# Altium schematic sheet SCH_WINGLET_PWR.SchDoc: Winglet Power Supply
size B; DrawnBy: HCAdam; Organization: Aerospace Village; DocumentNumber: WINGLET; Revision: A; SheetNumber: 2; SheetTotal: 10
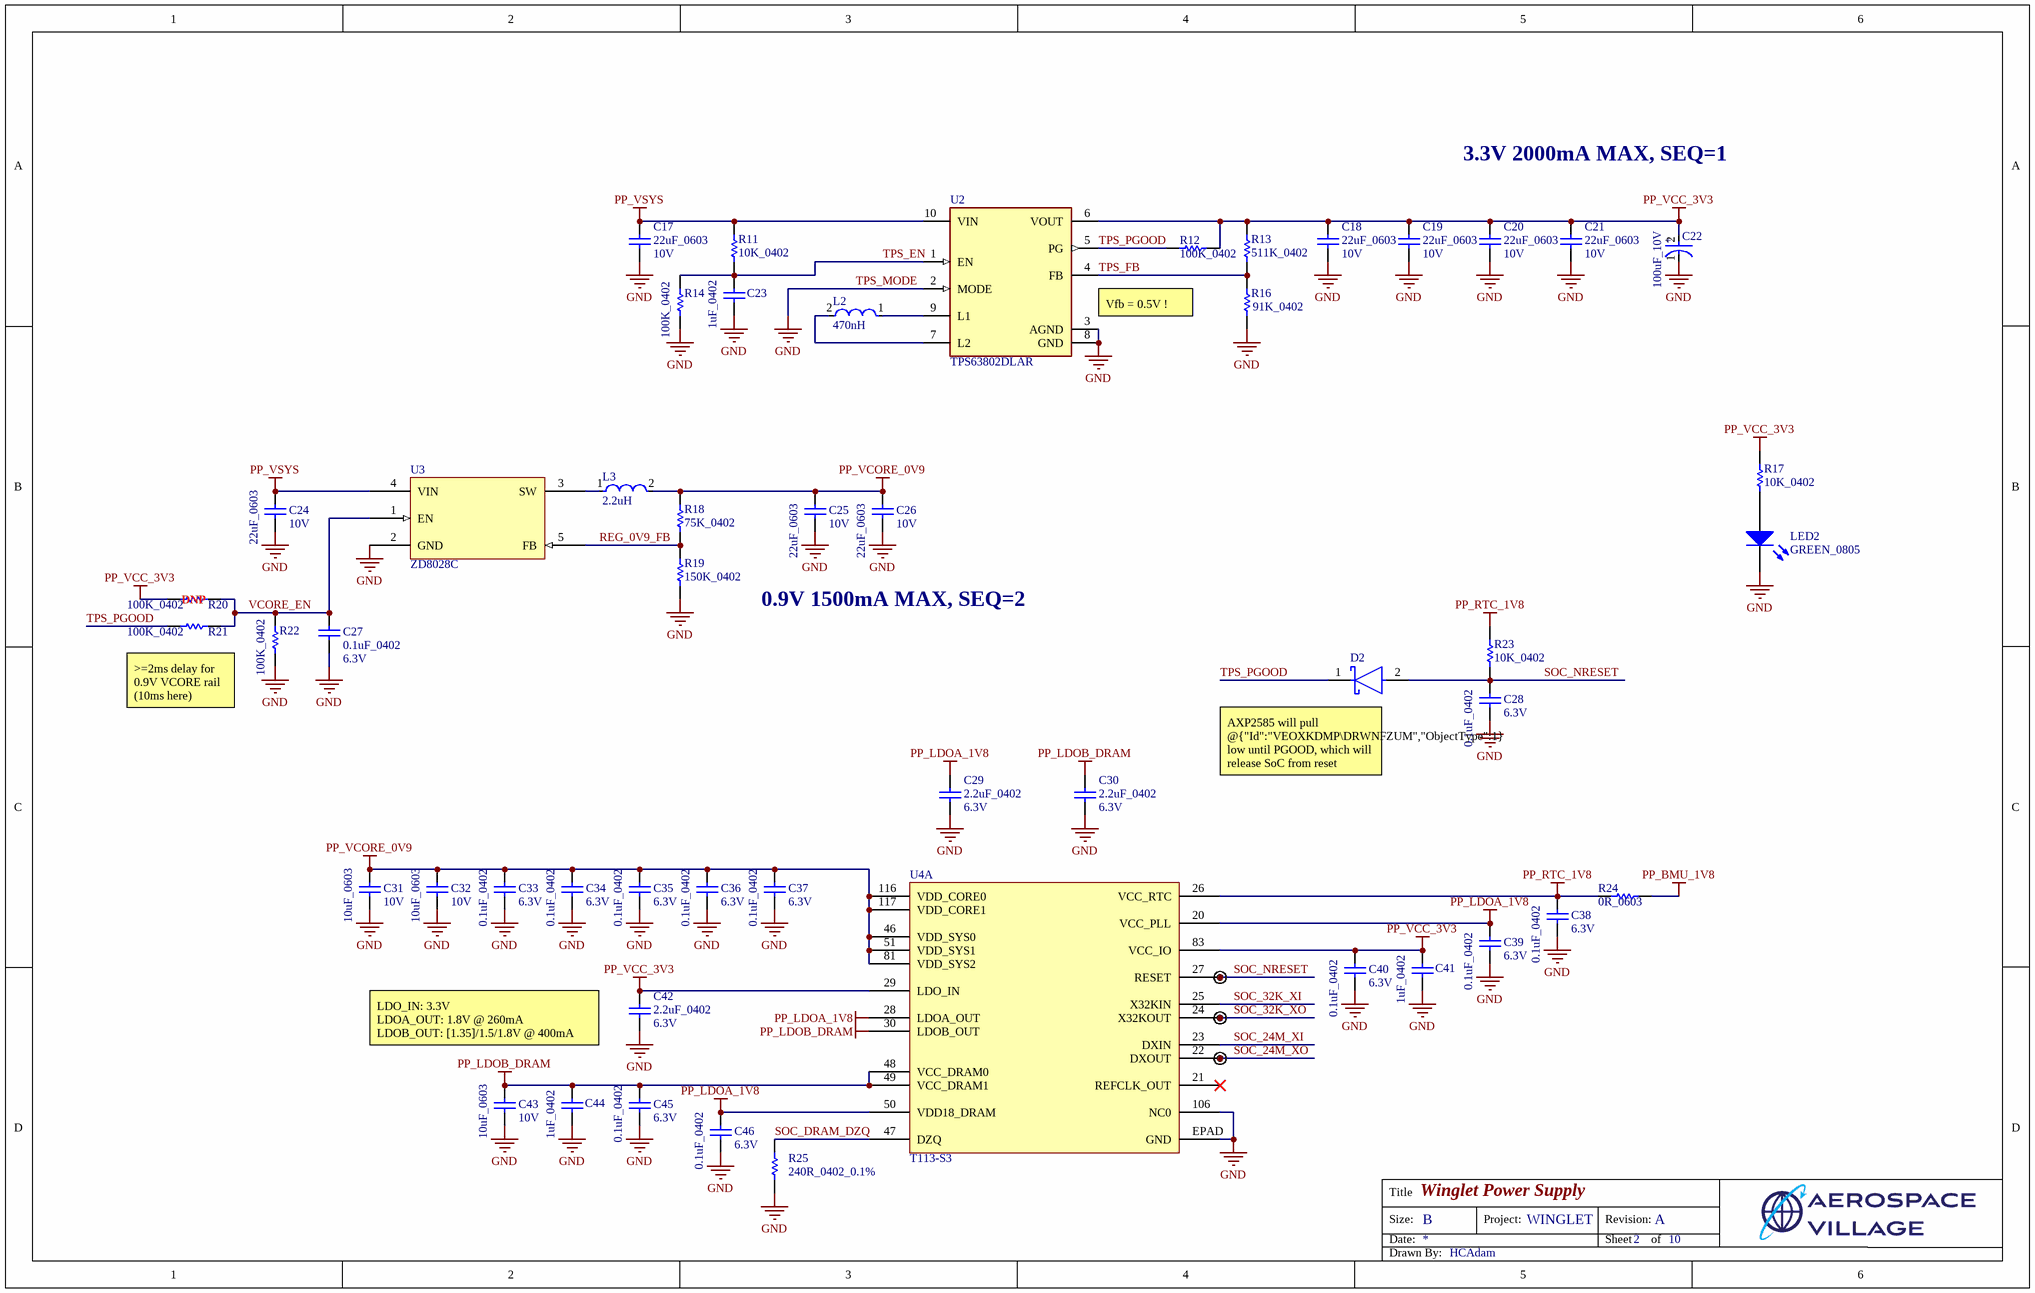
[diagram p0: SCH_WINGLET_PWR.SchDoc]

## Parts
C17  22uF_0603  Voltage Rating: 10V  [CAPC1608X100X20NL10]
C18  22uF_0603  Voltage Rating: 10V  [CAPC1608X100X20NL10]
C19  22uF_0603  Voltage Rating: 10V  [CAPC1608X100X20NL10]
C20  22uF_0603  Voltage Rating: 10V  [CAPC1608X100X20NL10]
C21  22uF_0603  Voltage Rating: 10V  [CAPC1608X100X20NL10]
C22  100uF_10V  [FP-TAJB-MFG]
C23  1uF_0402  [CAPC1005X55X25NL5T10]
C24  22uF_0603  Voltage Rating: 10V  [CAPC1608X100X20NL10]
C25  22uF_0603  Voltage Rating: 10V  [CAPC1608X100X20NL10]
C26  22uF_0603  Voltage Rating: 10V  [CAPC1608X100X20NL10]
C27  0.1uF_0402  Voltage Rating: 6.3V  [CAPC1005X56X25NL10T15]
C28  0.1uF_0402  Voltage Rating: 6.3V  [CAPC1005X56X25NL10T15]
C29  2.2uF_0402  Voltage Rating: 6.3V  [CAPC1005X55X25NL05T10]
C30  2.2uF_0402  Voltage Rating: 6.3V  [CAPC1005X55X25NL05T10]
C31  10uF_0603  Voltage Rating: 10V  [CAPC1609X100X15NL20]
C32  10uF_0603  Voltage Rating: 10V  [CAPC1609X100X15NL20]
C33  0.1uF_0402  Voltage Rating: 6.3V  [CAPC1005X56X25NL10T15]
C34  0.1uF_0402  Voltage Rating: 6.3V  [CAPC1005X56X25NL10T15]
C35  0.1uF_0402  Voltage Rating: 6.3V  [CAPC1005X56X25NL10T15]
C36  0.1uF_0402  Voltage Rating: 6.3V  [CAPC1005X56X25NL10T15]
C37  0.1uF_0402  Voltage Rating: 6.3V  [CAPC1005X56X25NL10T15]
C38  0.1uF_0402  Voltage Rating: 6.3V  [CAPC1005X56X25NL10T15]
C39  0.1uF_0402  Voltage Rating: 6.3V  [CAPC1005X56X25NL10T15]
C40  0.1uF_0402  Voltage Rating: 6.3V  [CAPC1005X56X25NL10T15]
C41  1uF_0402  [CAPC1005X55X25NL5T10]
C42  2.2uF_0402  Voltage Rating: 6.3V  [CAPC1005X55X25NL05T10]
C43  10uF_0603  Voltage Rating: 10V  [CAPC1609X100X15NL20]
C44  1uF_0402  [CAPC1005X55X25NL5T10]
C45  0.1uF_0402  Voltage Rating: 6.3V  [CAPC1005X56X25NL10T15]
C46  0.1uF_0402  Voltage Rating: 6.3V  [CAPC1005X56X25NL10T15]
D2  BAT54KFILM  [FP-SOD-523-MFG]  (value not drawn)
L2  470nH  [FP-DFE252012C-IPC_A]
L3  2.2uH  [FP-NR3015-MFG]
LED2  GREEN_0805  [0805_A]
R11  10K_0402  [RESC1005X40X25NL05T05]
R12  100K_0402  [RESC1005X40X25NL05T10]
R13  511K_0402  [RESC1005X40X25NL05T10]
R14  100K_0402  [RESC1005X40X25NL05T10]
R16  91K_0402  [RESC1005X40X25NL05T10]
R17  10K_0402  [RESC1005X40X25NL05T05]
R18  75K_0402  [RESC1005X40X25NL05T05]
R19  150K_0402  [RESC1005X40X25NL05T05]
R20  100K_0402  [RESC1005X40X25NL05T10]
R21  100K_0402  [RESC1005X40X25NL05T10]
R22  100K_0402  [RESC1005X40X25NL05T10]
R23  10K_0402  [RESC1005X40X25NL05T05]
R24  0R_0603  [RESC1608X55X25LL10T15]
R25  240R_0402_0.1%  [RESC1005X40X25NL05T05]
TP4  TESTPOINT  [TESTPOINT-0.7MM-SINGLE-LAYER]  (value not drawn)  (no BOM)
TP5  TESTPOINT  [TESTPOINT-0.7MM-SINGLE-LAYER]  (value not drawn)  (no BOM)
TP6  TESTPOINT  [TESTPOINT-0.7MM-SINGLE-LAYER]  (value not drawn)  (no BOM)
U2  TPS63802DLAR  [FP-DLA0010A-MFG]
U3  ZD8028C  [SOT95P292X115-5N]
U4  T113-S3  [TSQFP40P1600X1600X160_HS-129N]  (part A of 7)

## Nets
PP_BMU_1V8: R24.2
PP_LDOA_1V8: C29.2 C39.2 C46.2 U4.20(VCC_PLL) U4.28(LDOA_OUT) U4.50(VDD18_DRAM)
PP_LDOB_DRAM: C30.2 C43.2 C44.2 C45.2 U4.30(LDOB_OUT) U4.48(VCC_DRAM0) U4.49(VCC_DRAM1)
PP_RTC_1V8: C38.2 R23.2 R24.1 U4.26(VCC_RTC)
PP_VCC_3V3: C18.2 C19.2 C20.2 C21.2 C22.2(A) C40.2 C41.2 C42.2 R12.2 R13.1 R17.2 R20.2 U2.6(VOUT) U4.29(LDO_IN) U4.83(VCC_IO)
PP_VCORE_0V9: C25.2 C26.2 C31.2 C32.2 C33.2 C34.2 C35.2 C36.2 C37.2 L3.2 R18.2 U4.46(VDD_SYS0) U4.51(VDD_SYS1) U4.81(VDD_SYS2) U4.116(VDD_CORE0) U4.117(VDD_CORE1)
PP_VSYS: C17.2 C24.2 R11.1 U2.10(VIN) U3.4(VIN)
TPS_MODE: C17.1 C18.1 C19.1 C20.1 C21.1 C22.1(C) C23.1 C24.1 C25.1 C26.1 C27.1 C28.1 C29.1 C30.1 C31.1 C32.1 C33.1 C34.1 C35.1 C36.1 C37.1 C38.1 C39.1 C40.1 C41.1 C42.1 C43.1 C44.1 C45.1 C46.1 LED2.1(K) R14.2 R16.2 R19.1 R22.2 R25.1 U2.2(MODE) U2.3(AGND) U2.8(GND) U3.2(GND) U4.106(NC0) U4.EPAD(GND)  [also labelled GND]
REG_0V9_FB: R18.1 R19.2 U3.5(FB)
SOC_24M_XI: U4.23(DXIN)
SOC_24M_XO: TP6.1 U4.22(DXOUT)
SOC_32K_XI: U4.25(X32KIN)
SOC_32K_XO: TP5.1 U4.24(X32KOUT)
SOC_DRAM_DZQ: R25.2 U4.47(DZQ)
SOC_NRESET: C28.2 D2.2(A) R23.1 TP4.1 U4.27(RESET)
TPS_EN: C23.2 R11.2 R14.1 U2.1(EN)
TPS_FB: R13.2 R16.1 U2.4(FB)
TPS_PGOOD: D2.1(C) R12.1 R21.2 U2.5(PG)
VCORE_EN: C27.2 R20.1 R21.1 R22.1 U3.1(EN)
NetL2_1: L2.1 U2.9(L1)
NetL2_2: L2.2 U2.7(L2)
NetL3_1: L3.1 U3.3(SW)
NetLED2_2: LED2.2(A) R17.1

Not connected (* = marked no-connect by the designer): U4 21(REFCLK_OUT)*

## Notes on the sheet
- 3.3V 2000mA MAX, SEQ=1
- Vfb = 0.5V !
- 0.9V 1500mA MAX, SEQ=2
- >=2ms delay for 0.9V VCORE rail (10ms here)
- (near D2) AXP2585 will pull @{"Id":"VEOXKDMP\DRWNFZUM","ObjectType":1} low until PGOOD, which will release SoC from reset
- LDO_IN: 3.3V
  LDOA_OUT: 1.8V @ 260mA
  LDOB_OUT: [1.35]/1.5/1.8V @ 400mA
- Title
- Size:
- Date:
- B
- Project:
- Revision:
- Sheet
- of
- Drawn By:
- (in symbol CMP-04424-000366-1) +

## Library data of the parts
C17-C21 C24-C26 = CMP-2000-05441-1: Chip Capacitor, 22 uF, +/- 20%, 10 V, -55 to 85 degC, 0603 (1608 Metric), RoHS, Tape and Reel / PN: C1608X5R1A226M080AC; Manufacturer: TDK; PCN Part Number: MLCCPartNumberChange30/Nov/2012; Product Training Modules: CSeriesGeneralApplicationsSEAT,CCV,andTVCLDesignToolsGuidetoReplacinganElectrolyticCapacitorwithanMLCC; Other Names: 445-9077-1; Design Resources: 20WNon-IsolatedBuckLEDDriverUsingPLLNK460KG; Online Catalog: CSeries,GeneralPurpose; Capacitance: 22µF; Temperature Coefficient: X5R; Kits: 445-9014-KIT-ND-KITMLCC100PF-22UF060310-50V; Packaging: CutTape(CT); Standard Package: 1; Package / Case: 0603(1608Metric); Lead Style: -; Features: -; Ratings: -; Voltage - Rated: 10V; Operating Temperature: -55degC~85degC; Applications: GeneralPurpose; Package Reference: 603; Datasheet URL: http://download.siliconexpert.com/pdfs/2015/4/21/15/54/45/779/tdk_/manual/37024850441143360mlcc_commercial_general_en.pdf; Datasheet Version: Mar-15; Mounting Type: SurfaceMount,MLCC; Lead Spacing: -; Size / Dimension: 0.063"Lx0.031"W(1.60mmx0.80mm); Height - Seated (Max): -; Package Description: 2-Pin Surface Mount Device, Body 1.6 x 0.8 mm; Manufacturer URL: http://www.tdk.com/; RoHS Information: RoHSCertificate-MLCC; Tolerance: ±20%; Series: C; Thickness (Max): 0.035"(0.90mm); Family: CeramicCapacitors; Category: Capacitors
C22 = CMP-04424-000366-1: 100uF 10V ±10% 1.7Ω SMD CASE-B (3528) Tantalum Capacitor; Voltage Rating (DC): 6.3V; ESR (Equivalent Series Resistance): 1.7R; Polarity: Polar; Leakage Current: 6.3uA; Height: 1.9mm; Depth: 2.8mm; Length: 3.5mm; Min Operating Temperature: -55°C; Width: 2.8mm; Series: TAJ; Lead Free: Lead Free; Case/Package: 1210; Voltage: 6.3V; Mount: Surface Mount; Tolerance: 10%; Capacitance: 100uF; Radiation Hardening: No; REACH SVHC: No SVHC; Voltage Rating: 6.3V; Case Code (Metric): 3528; Dissipation Factor: 10%; Packaging: Tape and Reel; Construction: Flat; Features: General Purpose; Max Operating Temperature: 125°C; RoHS Compliant: Yes; Package Quantity: 1; Dielectric Material: Tantalum; Termination: SMD/SMT; Case Code (Imperial): 1210; Height - Seated (Max): 0.083inch
C23 C41 C44 = CMP-1662-00020-1: Chip Capacitor, 1 uF, +/- 10%, 6.3 V, -55 to 85 degC, 0402 (1005 Metric), RoHS, Tape and Reel / GRM155R60J105KE19D; Voltage Rating (DC): 3 V; Type (Capacitors): X5R; Voltage Rating: 6.3 V; Capacitance: 1 uF; ComponentLink2Description: Datasheet; ComponentLink2URL: http://psearch.en.murata.com/capacitor/product/GRM155R60J105KE19%23.pdf; Max Operating Temperature: 85 degC; Min Operating Temperature: -55 degC; Package Quantity: 10000; Mounting Technology: Surface Mount; ComponentLink1Description: Manufacturer URL; ComponentLink1URL: http://www.murata.com/; PackageDescription: 2-Pin Surface Mount Device, Body 1 x 0.5 mm; Tolerance: 10%; Case/Package: 0402; Mount: Surface Mount; Packaging: Tape and Reel; Case Code (Metric): 1005; Radiation Hardening: No; Width: 0.5 mm; Length: 1 mm; DatasheetVersion: 08/2016; Height: 0.5 mm; PartNumber: GRM155R60J105KE19D; RoHSCompliant: true; Case Code (Imperial): 0402; REACH SVHC: No SVHC; Pins: 2
C27 C28 C33-C40 C45 C46 = CMP-2008-02743-1: 04026D104KAT2A; Manufacturer: AVX Interconnect / Elco; Part Number: 04026D104KAT2A
C29 C30 C42 = CMP-2008-04543-1: GRM155R60J225ME15D; Manufacturer: Murata; Part Number: GRM155R60J225ME15D
C31 C32 C43 = CMP-2006-00191-1: Part Number: TACL106M006XTA; Manufacturer: AVX Interconnect / Elco
D2 = CMP-12187-000026-1: DIODE SCHOTTKY 40V 300MA SOD523; Manufacturer: STMicroelectronics; Capacitance: 7pF; Value: 7pF; Max Surge Forward Current: 1.25A; Peak Reverse Current: 1uA; Max Junction Temp: +150°C; Device Class L2: Diodes; Temperature Range Low: -40°C; Category: Diode; Manufacturer Part Number: BAT54KFILM; Digikey Description: DIODE SCHOTTKY 40V 300MA SOD523; Device Class L3: Schottky Diodes; Automotive: No; Height: 0.7mm; Octopart: https://octopart.com/bat54kfilm-stmicroelectronics-39618022; ComponentLink2Description: Datasheet; Temperature Range High: +150°C; Device Class L1: Discrete Semiconductors; Max Repetitive Reverse Voltage: 40V; RoHS: TRUE; Temperature: -40°C to +150°C; ComponentLink2URL: https://www.st.com/content/ccc/resource/technical/document/datasheet/07/50/54/f2/0d/ba/4a/79/CD00001322.pdf/files/CD00001322.pdf/jcr:content/translations/en.CD00001322.pdf; Lead Free: Yes; Forward Current: 300mA; Package: SOD-523; Mouser Description: Schottky Diodes & Rectifiers schottky diode
L2 = CMP-06042-015149-1: Shielded Wirewound Inductor 0.47uH 20% 4000mA 0.027Ω 1008 (2520) / DFE252012PD-R47M
L3 = CMP-0569-00001-3: SMD Power Inductors 2.2uH ±20% 1.48A 72mΩ / NR3015T2R2M; RMS Current (Irms): 1.5A; Shielding: Shielded; Self Resonant Frequency: 64MHz; Test Frequency: 100kHz; DC Resistance (DCR): 72mR; Core Material: Ferrite; Package Quantity: 1; Current Rating: 1.48A; Height - Seated (Max): 0.059inch; Width: 0.118inch; Inductance Tolerance: 20%; Tolerance: 20%; Resistor Type: Wirewound; RoHS Compliant: Yes; Case/Package: 3015; Length: 0.118inch; Max DC Current: 1.5A; Max Operating Temperature: 120°C; Inductance: 2.2uH; Saturation Current: 1.48A; Min Operating Temperature: -25°C; Height: 1.5mm; Series: NR; Lead Free: Lead Free; Packaging: Tape and Reel; Halogen Free: Halogen Free; Termination: SMD/SMT; Number of Pins: 2
LED2 = CMP-1426-00007-1: SMD mono-color Chip LED, WL-SMCW, Green / 150080GS75000; Manufacturer: Wuerth Elektronik; PackageReference: 0805_A; Color: Green; PartNumber: 150080GS75000; ComponentLink2URL: http://katalog.we-online.com/led/datasheet/150080GS75000.pdf; ComponentLink1URL: http://www.we-online.com; ComponentLink1Description: Manufacturer URL; ComponentLink2Description: Datasheet
R11 R17 R23 = CMP-2000-07588-1: Chip Resistor, 10 KOhm, +/- 1%, 0.1 W, -55 to 155 degC, 0402 (1005 Metric), RoHS, Tape and Reel / ERJ2RKF1002X; Manufacturer: Panasonic; Power Rating: 100mW; Voltage Rating: 50V; Resistance: 10KOhm; Case\/Package: 0402; Temperature Coefficient: 100ppm\/degreesC; RoHSCompliant: True; Lead Free: LeadFree; Package Quantity: 1; Contact Plating: Tin; Length: 1mm; Radiation Hardening: No; REACH SVHC: NoSVHC; Max Operating Temperature: 155degC; Depth: 0.5mm; Case Code (Imperial): 0402; Military Standard: Not; Package Description: 2-Pin Surface Mount Device, Body 1 x 0.5 mm; Termination: SMD/SMT; Case Code (Metric): 1005; Height: 0.35mm; Packaging: TapeandReel; Voltage Rating (DC): 50V; Package Reference: 402; Number of Pins: 2; Tolerance: 1%; Mounting Technology: SurfaceMount; Width: 0.02inch; Mount: SurfaceMount; Datasheet URL: https://industrial.panasonic.com/cdbs/www-data/pdf/RDA0000/AOA0000C304.pdf; Composition: ThickFilm; Datasheet Version: 02/2017; Manufacturer URL: http://www.panasonic.com/; Max Power Dissipation: 100mW; Number of Terminations: 2; Min Operating Temperature: -55degC
R12-R14 R16 R20-R22 = CMP-2002-07343-1: RC0402FR-07100KL; Manufacturer: Yageo / Phycomp; Part Number: RC0402FR-07100KL
  R20: DNP: DNP
R18 = CMP-2000-07588-1: Manufacturer: Panasonic; Power Rating: 100mW; Voltage Rating: 50V; Resistance: 10KOhm; Tolerance: 1%; Case\/Package: 0402; Temperature Coefficient: 100ppm\/degreesC; RoHSCompliant: True; Lead Free: LeadFree; Package Quantity: 1; Contact Plating: Tin; Length: 1mm; Radiation Hardening: No; REACH SVHC: NoSVHC; Max Operating Temperature: 155degC; Depth: 0.5mm; Case Code (Imperial): 0402; Military Standard: Not; Package Description: 2-Pin Surface Mount Device, Body 1 x 0.5 mm; Termination: SMD/SMT; Case Code (Metric): 1005; Height: 0.35mm; Packaging: TapeandReel; Voltage Rating (DC): 50V; Package Reference: 402; Number of Pins: 2; Mounting Technology: SurfaceMount; Width: 0.02inch; Mount: SurfaceMount; Datasheet URL: https://industrial.panasonic.com/cdbs/www-data/pdf/RDA0000/AOA0000C304.pdf; Composition: ThickFilm; Datasheet Version: 02/2017; Manufacturer URL: http://www.panasonic.com/; Max Power Dissipation: 100mW; Number of Terminations: 2; Min Operating Temperature: -55degC
R19 = CMP-2000-07588-1: RC0402FR-07150KL; Manufacturer: Panasonic; Power Rating: 100mW; Voltage Rating: 50V; Resistance: 10KOhm; Tolerance: 1%; Case\/Package: 0402; Temperature Coefficient: 100ppm\/degreesC; RoHSCompliant: True; Lead Free: LeadFree; Package Quantity: 1; Contact Plating: Tin; Length: 1mm; Radiation Hardening: No; REACH SVHC: NoSVHC; Max Operating Temperature: 155degC; Depth: 0.5mm; Case Code (Imperial): 0402; Military Standard: Not; Package Description: 2-Pin Surface Mount Device, Body 1 x 0.5 mm; Termination: SMD/SMT; Case Code (Metric): 1005; Height: 0.35mm; Packaging: TapeandReel; Voltage Rating (DC): 50V; Package Reference: 402; Number of Pins: 2; Mounting Technology: SurfaceMount; Width: 0.02inch; Mount: SurfaceMount; Datasheet URL: https://industrial.panasonic.com/cdbs/www-data/pdf/RDA0000/AOA0000C304.pdf; Composition: ThickFilm; Datasheet Version: 02/2017; Manufacturer URL: http://www.panasonic.com/; Max Power Dissipation: 100mW; Number of Terminations: 2; Min Operating Temperature: -55degC
R24 = CMP-2000-04300-1: RC0603JR-100RL; Manufacturer: Yageo; Part Number: RC0603JR-100RL
R25 = CMP-1665-00034-1: Chip Resistor, 240 Ohm, +/- 1%, 100 mW, -55 to 155 degC, 0402 (1005 Metric), RoHS, Tape and Reel, ERJ-2RKF2400X; Voltage Rating: 50 V; Resistance: 240 Ohm; Case\/Package: 0402; Power Rating: 100 mW; Package Quantity: 10000; Length: 1 mm; PackageDescription: 2-Pin Surface Mount Device, Body 1 x 0.5 mm; Packaging: Tape and Reel; Tolerance: 1%; REACH SVHC: Unknown; ComponentLink1URL: http://www.panasonic.com/; Radiation Hardening: No; Height: 0.35 mm; Mounting Technology: Surface Mount; ComponentLink2Description: Datasheet; Width: 0.5 mm; ComponentLink2URL: http://industrial.panasonic.com/cdbs/www-data/pdf/RDA0000/AOA0000C86.pdf; PartNumber: ERJ-2RKF2400X; PackageReference: 0402; Case Code (Imperial): 0402; Case Code (Metric): 1005; ComponentLink1Description: Manufacturer URL; Mount: Surface Mount; RoHSCompliant: true; Max Operating Temperature: 155 degC; DatasheetVersion: 04/2015; Min Operating Temperature: -55 degC; Pins: 2; DNP: DNP
TP4-TP6 = TP_07: TESTPOINT SINGLE LAYER 0.7MM; AEC-Q: Yes; PPAP: Unknown; Selective Soldering: No; Value: Unknown; RoHS: Yes; Package: BOARD_FEATURE; Washable: Yes; Mounting: Unknown
U2 = CMP-04918-000005-1: IC POWER MANAGEMENT; Manufacturer: Texas Instruments; Nominal Supply Current: 11uA; Max Junction Temp: +125°C; Max Supply Voltage: 5.5V; Switching Topology: Buck-Boost; Min Supply Voltage: 1.3V; Output Current: 2A; Output Voltage: 1.8-5.2V; Number Of Outputs: 1; Switching Frequency: 1.4/1.6/2.1MHz; Standoff Height: 0mm; Max Duty Cycle: 100%; Output Type: AdjustableProgrammable; Manufacturer Part Number: TPS63802DLAR; ComponentLink2URL: https://www.ti.com/lit/ds/symlink/tps63802.pdf; Digikey Description: IC POWER MANAGEMENT; Octopart: https://octopart.com/tps63802dlar-texas+instruments-97359678; Height: 1mm; Temperature: -40°C to +125°C; Device Class L3: Voltage Regulators - Switching; Lead Free: Yes; Category: IC; Mouser Description: 2-A, high-efficient, 11-µA quiescent current buck-boost converter in QFN/DFN package 10-VSON-HR -40 to 125; ComponentLink2Description: Datasheet; Temperature Range Low: -40°C; Temperature Range High: +125°C; Automotive: No; Device Class L2: Power Management ICs; RoHS: TRUE; Device Class L1: Integrated Circuits (ICs); Package: DLA0010A
U3 = ZD8028C: 1.5A 2MHz 5.5V Synchronous Buck Converter
U4 = T113-S3: Allwinner Dual-core ARM Cortex-A7 Smart Control and Display SoC